# Altium schematic sheet GPS.SchDoc
size A
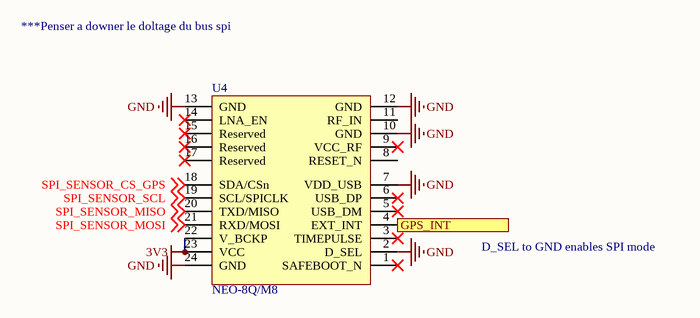
[diagram p0: GPS.SchDoc]

## Parts
U4  NEO-8Q/M8  [NEO-8Q/M8]

## Ports
GPS_INT

## Nets
3V3: U4.22(V_BCKP) U4.23(VCC)
GND: U4.2(D_SEL) U4.7(VDD_USB) U4.10(GND) U4.12(GND) U4.13(GND) U4.24(GND)
GPS_INT: U4.4(EXT_INT) ; port GPS_INT
SPI_SENSOR_CS_GPS: U4.18(SDA/CSn) ; off-sheet SPI_SENSOR_CS_GPS
SPI_SENSOR_MISO: U4.20(TXD/MISO) ; off-sheet SPI_SENSOR_MISO
SPI_SENSOR_MOSI: U4.21(RXD/MOSI) ; off-sheet SPI_SENSOR_MOSI
SPI_SENSOR_SCL: U4.19(SCL/SPICLK) ; off-sheet SPI_SENSOR_SCL

Not connected (* = marked no-connect by the designer): U4 1(SAFEBOOT_N)* 3(TIMEPULSE)* 5(USB_DM)* 6(USB_DP)* 8(RESET_N) 9(VCC_RF)* 11(RF_IN) 14(LNA_EN)* 15(Reserved)* 16(Reserved)* 17(Reserved)*

## Notes on the sheet
- ***Penser a downer le doltage du bus spi
- D_SEL to GND enables SPI mode